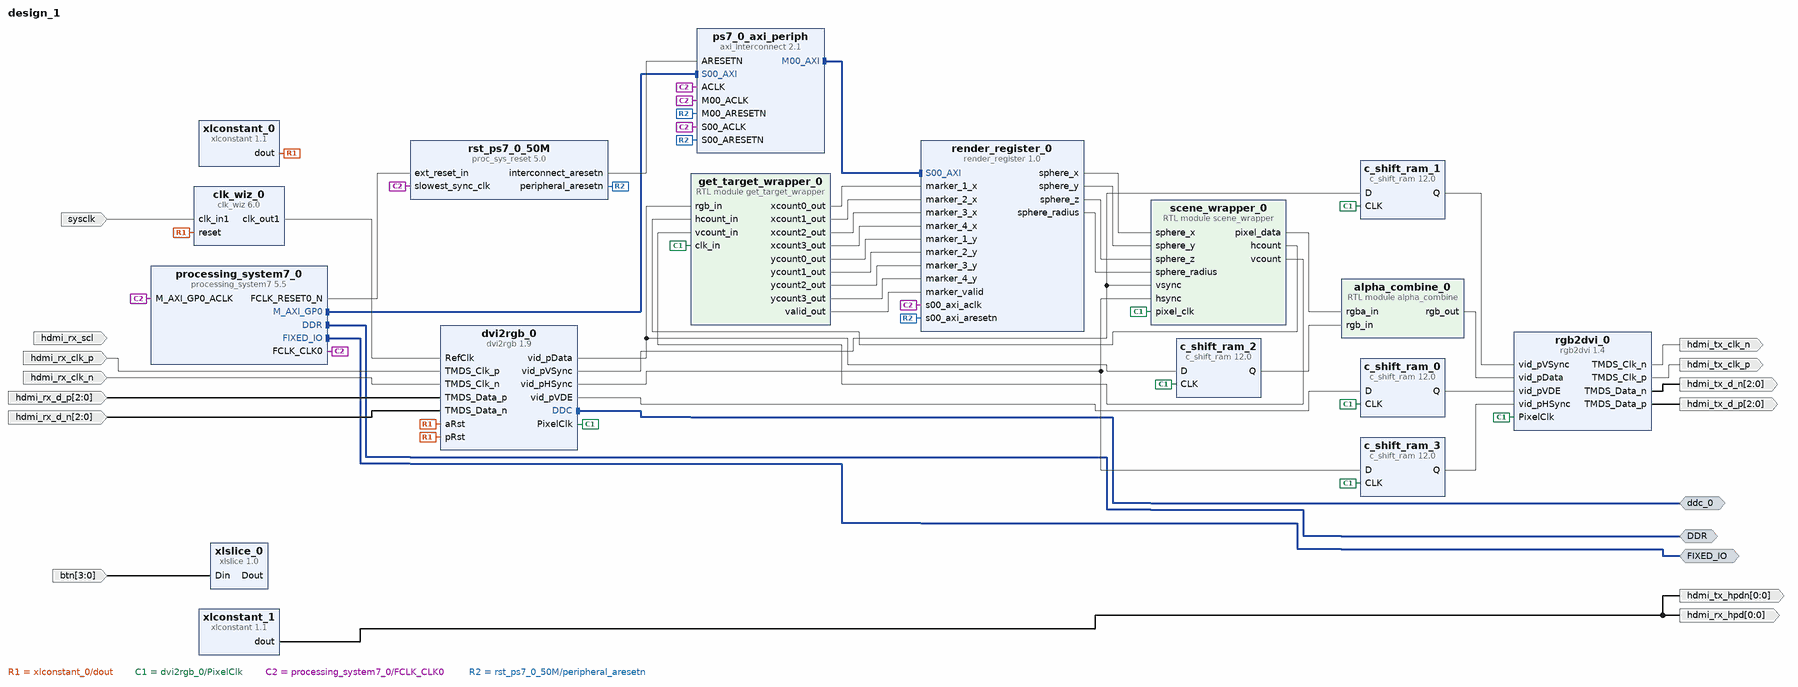
[diagram p0: block diagram of the top level]
# Vivado block design design_1, xc7z020clg400-1, Vivado 2018.2
create_bd_design design_1

create_bd_intf_port -mode Master -vlnv xilinx.com:interface:iic_rtl:1.0 ddc_0
create_bd_intf_port -mode Master -vlnv xilinx.com:interface:ddrx_rtl:1.0 DDR
create_bd_intf_port -mode Master -vlnv xilinx.com:display_processing_system7:fixedio_rtl:1.0 FIXED_IO
create_bd_port -dir I hdmi_rx_scl
create_bd_port -dir I -type clk hdmi_rx_clk_p
create_bd_port -dir I -type clk hdmi_rx_clk_n
create_bd_port -dir I -from 2 -to 0 -type data hdmi_rx_d_p
create_bd_port -dir I -from 2 -to 0 -type data hdmi_rx_d_n
create_bd_port -dir O -type clk hdmi_tx_clk_p
create_bd_port -dir O -type clk hdmi_tx_clk_n
create_bd_port -dir O -from 2 -to 0 -type data hdmi_tx_d_p
create_bd_port -dir O -from 2 -to 0 -type data hdmi_tx_d_n
create_bd_port -dir O -from 0 -to 0 hdmi_tx_hpdn
create_bd_port -dir O -from 0 -to 0 hdmi_rx_hpd
create_bd_port -dir I -type clk sysclk
set_property -dict {CONFIG.FREQ_HZ 125000000} [get_bd_ports sysclk]
create_bd_port -dir I -from 3 -to 0 -type data btn

create_bd_cell -type ip -vlnv xilinx.com:ip:xlconstant:1.1 xlconstant_0
set_property -dict {CONFIG.CONST_VAL 0} [get_bd_cells xlconstant_0]
create_bd_cell -type ip -vlnv xilinx.com:ip:xlconstant:1.1 xlconstant_1
create_bd_cell -type ip -vlnv xilinx.com:ip:clk_wiz:6.0 clk_wiz_0
set_property -dict [list \
  CONFIG.ENABLE_CLOCK_MONITOR false \
  CONFIG.PRIMITIVE PLL \
  CONFIG.PRIM_IN_FREQ 125.000 \
  CONFIG.CLKIN1_JITTER_PS 80.0 \
  CONFIG.CLKOUT1_REQUESTED_OUT_FREQ 200.000 \
  CONFIG.CLKOUT1_DRIVES BUFG \
  CONFIG.CLKOUT2_DRIVES BUFG \
  CONFIG.CLKOUT3_DRIVES BUFG \
  CONFIG.CLKOUT4_DRIVES BUFG \
  CONFIG.CLKOUT5_DRIVES BUFG \
  CONFIG.CLKOUT6_DRIVES BUFG \
  CONFIG.CLKOUT7_DRIVES BUFG \
  CONFIG.MMCM_DIVCLK_DIVIDE 1 \
  CONFIG.MMCM_CLKFBOUT_MULT_F 8 \
  CONFIG.MMCM_CLKIN1_PERIOD 8.000 \
  CONFIG.MMCM_CLKIN2_PERIOD 10.0 \
  CONFIG.MMCM_COMPENSATION ZHOLD \
  CONFIG.MMCM_CLKOUT0_DIVIDE_F 5 \
  CONFIG.CLKOUT1_JITTER 109.241 \
  CONFIG.CLKOUT1_PHASE_ERROR 96.948 \
] [get_bd_cells clk_wiz_0]
create_bd_cell -type ip -vlnv xilinx.com:ip:c_shift_ram:12.0 c_shift_ram_0
set_property -dict {CONFIG.Width 1 CONFIG.Depth 53 CONFIG.DefaultData 0 CONFIG.AsyncInitVal 0} [get_bd_cells c_shift_ram_0]
create_bd_cell -type ip -vlnv xilinx.com:ip:c_shift_ram:12.0 c_shift_ram_1
set_property -dict {CONFIG.Width 1 CONFIG.Depth 53 CONFIG.DefaultData 0 CONFIG.AsyncInitVal 0} [get_bd_cells c_shift_ram_1]
create_bd_cell -type ip -vlnv xilinx.com:ip:c_shift_ram:12.0 c_shift_ram_2
set_property -dict [list \
  CONFIG.Width 24 \
  CONFIG.Depth 53 \
  CONFIG.DefaultData 000000000000000000000000 \
  CONFIG.AsyncInitVal 000000000000000000000000 \
] [get_bd_cells c_shift_ram_2]
create_bd_cell -type ip -vlnv xilinx.com:ip:c_shift_ram:12.0 c_shift_ram_3
set_property -dict {CONFIG.Width 1 CONFIG.Depth 53 CONFIG.DefaultData 0 CONFIG.AsyncInitVal 0} [get_bd_cells c_shift_ram_3]
create_bd_cell -type ip -vlnv xilinx.com:ip:processing_system7:5.5 processing_system7_0
# 1 more settings of processing_system7_0 are not shown: defaults, MIO pin electricals, DDR timing, and values the tool derives
create_bd_cell -type ip -vlnv xilinx.com:ip:axi_interconnect:2.1 ps7_0_axi_periph
set_property -dict {CONFIG.NUM_MI 1} [get_bd_cells ps7_0_axi_periph]
create_bd_cell -type ip -vlnv xilinx.com:ip:proc_sys_reset:5.0 rst_ps7_0_50M
create_bd_cell -type module -reference alpha_combine alpha_combine_0
create_bd_cell -type ip -vlnv xilinx.com:ip:xlslice:1.0 xlslice_0
set_property -dict {CONFIG.DIN_TO 0 CONFIG.DIN_FROM 0 CONFIG.DIN_WIDTH 4} [get_bd_cells xlslice_0]
create_bd_cell -type module -reference scene_wrapper scene_wrapper_0
create_bd_cell -type ip -vlnv nippy.org:nippy:render_register:1.0 render_register_0
create_bd_cell -type ip -vlnv digilentinc.com:ip:dvi2rgb:1.9 dvi2rgb_0
set_property -dict {CONFIG.kClkRange 1} [get_bd_cells dvi2rgb_0]
create_bd_cell -type ip -vlnv digilentinc.com:ip:rgb2dvi:1.4 rgb2dvi_0
set_property -dict {CONFIG.kClkRange 1} [get_bd_cells rgb2dvi_0]
create_bd_cell -type module -reference get_target_wrapper get_target_wrapper_0

# ---- connections ----

connect_bd_intf_net [get_bd_intf_pins processing_system7_0/M_AXI_GP0] [get_bd_intf_pins ps7_0_axi_periph/S00_AXI]
connect_bd_intf_net [get_bd_intf_pins ps7_0_axi_periph/M00_AXI] [get_bd_intf_pins render_register_0/S00_AXI]
connect_bd_intf_net [get_bd_intf_ports ddc_0] [get_bd_intf_pins dvi2rgb_0/DDC]
connect_bd_intf_net [get_bd_intf_ports DDR] [get_bd_intf_pins processing_system7_0/DDR]
connect_bd_intf_net [get_bd_intf_ports FIXED_IO] [get_bd_intf_pins processing_system7_0/FIXED_IO]
connect_bd_net [get_bd_ports hdmi_rx_clk_p] [get_bd_pins dvi2rgb_0/TMDS_Clk_p]
connect_bd_net [get_bd_ports hdmi_rx_clk_n] [get_bd_pins dvi2rgb_0/TMDS_Clk_n]
connect_bd_net [get_bd_ports hdmi_rx_d_p] [get_bd_pins dvi2rgb_0/TMDS_Data_p]
connect_bd_net [get_bd_ports hdmi_rx_d_n] [get_bd_pins dvi2rgb_0/TMDS_Data_n]
connect_bd_net [get_bd_pins xlconstant_0/dout] [get_bd_pins clk_wiz_0/reset] [get_bd_pins dvi2rgb_0/aRst] [get_bd_pins dvi2rgb_0/pRst]
connect_bd_net [get_bd_pins rgb2dvi_0/TMDS_Clk_p] [get_bd_ports hdmi_tx_clk_p]
connect_bd_net [get_bd_pins rgb2dvi_0/TMDS_Clk_n] [get_bd_ports hdmi_tx_clk_n]
connect_bd_net [get_bd_pins rgb2dvi_0/TMDS_Data_p] [get_bd_ports hdmi_tx_d_p]
connect_bd_net [get_bd_pins rgb2dvi_0/TMDS_Data_n] [get_bd_ports hdmi_tx_d_n]
connect_bd_net [get_bd_pins xlconstant_1/dout] [get_bd_ports hdmi_rx_hpd] [get_bd_ports hdmi_tx_hpdn]
connect_bd_net [get_bd_ports sysclk] [get_bd_pins clk_wiz_0/clk_in1]
connect_bd_net [get_bd_pins clk_wiz_0/clk_out1] [get_bd_pins dvi2rgb_0/RefClk]
connect_bd_net [get_bd_pins dvi2rgb_0/PixelClk] \
  [get_bd_pins c_shift_ram_2/CLK] [get_bd_pins c_shift_ram_3/CLK] [get_bd_pins c_shift_ram_1/CLK] \
  [get_bd_pins c_shift_ram_0/CLK] [get_bd_pins scene_wrapper_0/pixel_clk] [get_bd_pins rgb2dvi_0/PixelClk] \
  [get_bd_pins get_target_wrapper_0/clk_in]
connect_bd_net [get_bd_pins scene_wrapper_0/pixel_data] [get_bd_pins alpha_combine_0/rgba_in]
connect_bd_net [get_bd_pins alpha_combine_0/rgb_out] [get_bd_pins rgb2dvi_0/vid_pData]
connect_bd_net [get_bd_pins dvi2rgb_0/vid_pData] [get_bd_pins c_shift_ram_2/D] [get_bd_pins get_target_wrapper_0/rgb_in]
connect_bd_net [get_bd_pins c_shift_ram_2/Q] [get_bd_pins alpha_combine_0/rgb_in]
connect_bd_net [get_bd_pins dvi2rgb_0/vid_pHSync] [get_bd_pins c_shift_ram_3/D] [get_bd_pins scene_wrapper_0/hsync]
connect_bd_net [get_bd_pins c_shift_ram_3/Q] [get_bd_pins rgb2dvi_0/vid_pHSync]
connect_bd_net [get_bd_pins dvi2rgb_0/vid_pVSync] [get_bd_pins c_shift_ram_1/D] [get_bd_pins scene_wrapper_0/vsync]
connect_bd_net [get_bd_pins c_shift_ram_1/Q] [get_bd_pins rgb2dvi_0/vid_pVSync]
connect_bd_net [get_bd_pins dvi2rgb_0/vid_pVDE] [get_bd_pins c_shift_ram_0/D]
connect_bd_net [get_bd_pins c_shift_ram_0/Q] [get_bd_pins rgb2dvi_0/vid_pVDE]
connect_bd_net [get_bd_pins processing_system7_0/FCLK_CLK0] \
  [get_bd_pins processing_system7_0/M_AXI_GP0_ACLK] [get_bd_pins rst_ps7_0_50M/slowest_sync_clk] \
  [get_bd_pins render_register_0/s00_axi_aclk] [get_bd_pins ps7_0_axi_periph/S00_ACLK] \
  [get_bd_pins ps7_0_axi_periph/M00_ACLK] [get_bd_pins ps7_0_axi_periph/ACLK]
connect_bd_net [get_bd_pins processing_system7_0/FCLK_RESET0_N] [get_bd_pins rst_ps7_0_50M/ext_reset_in]
connect_bd_net [get_bd_pins rst_ps7_0_50M/peripheral_aresetn] \
  [get_bd_pins render_register_0/s00_axi_aresetn] [get_bd_pins ps7_0_axi_periph/S00_ARESETN] \
  [get_bd_pins ps7_0_axi_periph/M00_ARESETN]
connect_bd_net [get_bd_pins rst_ps7_0_50M/interconnect_aresetn] [get_bd_pins ps7_0_axi_periph/ARESETN]
connect_bd_net [get_bd_pins render_register_0/sphere_x] [get_bd_pins scene_wrapper_0/sphere_x]
connect_bd_net [get_bd_pins render_register_0/sphere_y] [get_bd_pins scene_wrapper_0/sphere_y]
connect_bd_net [get_bd_pins render_register_0/sphere_z] [get_bd_pins scene_wrapper_0/sphere_z]
connect_bd_net [get_bd_pins render_register_0/sphere_radius] [get_bd_pins scene_wrapper_0/sphere_radius]
connect_bd_net [get_bd_ports btn] [get_bd_pins xlslice_0/Din]
# net xlslice_0_Dout has one end: xlslice_0/Dout
connect_bd_net [get_bd_pins scene_wrapper_0/hcount] [get_bd_pins get_target_wrapper_0/hcount_in]
connect_bd_net [get_bd_pins scene_wrapper_0/vcount] [get_bd_pins get_target_wrapper_0/vcount_in]
connect_bd_net [get_bd_pins get_target_wrapper_0/xcount0_out] [get_bd_pins render_register_0/marker_1_x]
connect_bd_net [get_bd_pins get_target_wrapper_0/xcount1_out] [get_bd_pins render_register_0/marker_2_x]
connect_bd_net [get_bd_pins get_target_wrapper_0/xcount2_out] [get_bd_pins render_register_0/marker_3_x]
connect_bd_net [get_bd_pins get_target_wrapper_0/xcount3_out] [get_bd_pins render_register_0/marker_4_x]
connect_bd_net [get_bd_pins get_target_wrapper_0/ycount0_out] [get_bd_pins render_register_0/marker_1_y]
connect_bd_net [get_bd_pins get_target_wrapper_0/ycount1_out] [get_bd_pins render_register_0/marker_2_y]
connect_bd_net [get_bd_pins get_target_wrapper_0/ycount2_out] [get_bd_pins render_register_0/marker_3_y]
connect_bd_net [get_bd_pins get_target_wrapper_0/ycount3_out] [get_bd_pins render_register_0/marker_4_y]
connect_bd_net [get_bd_pins get_target_wrapper_0/valid_out] [get_bd_pins render_register_0/marker_valid]

# ---- address map ----
assign_bd_address -offset 0x43C00000 -range 64K -target_address_space [get_bd_addr_spaces processing_system7_0/Data] [get_bd_addr_segs render_register_0/S00_AXI/S00_AXI_reg]

validate_bd_design
save_bd_design
